# Altium project Lucas Emanuel - PCEIoT.PrjPcb (part 2 of 2)

## Sheet [6] RgbLed.SchDoc
size A3; DocumentNumber: 6; SheetNumber: 6; SheetTotal: 9
Used 3 times, as channels ButtonsAndLeds/"RGB LEDs"1, ButtonsAndLeds/"RGB LEDs"2, ButtonsAndLeds/"RGB LEDs"3. Parts and nets are listed once, with the designators drawn on the sheet.
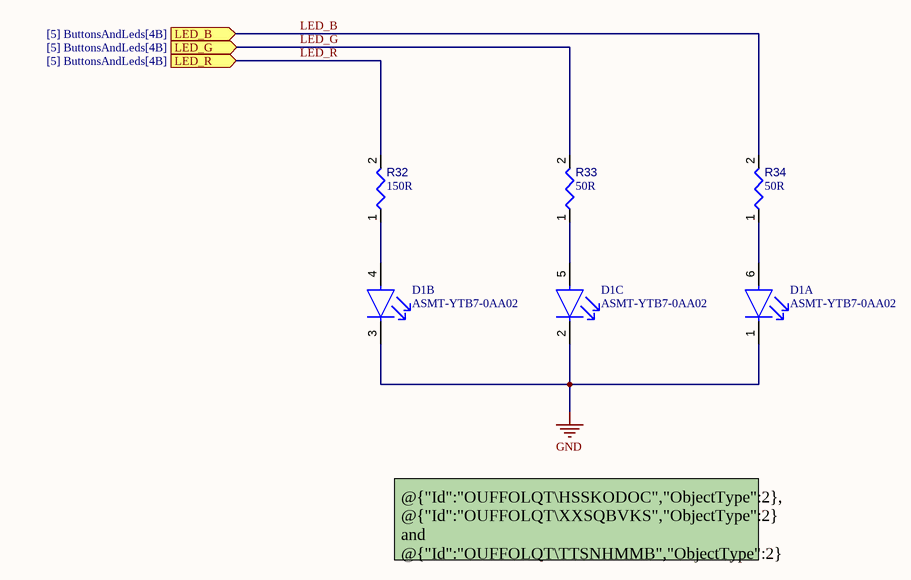
[diagram p7: [6] RgbLed.SchDoc]

### Parts
D1  ASMT-YTB7-0AA02  [FP-PLCC-6-MFG]  (parts A,B,C of 3)
R32  value 150R  [RESC0603(1608)_L]  (hidden comment: CRCW0603150RFKEA)
R33  value 50R  [RESC0603(1608)_L]  (hidden comment: CRCW060350R0FKEA)
R34  value 50R  [RESC0603(1608)_L]  (hidden comment: CRCW060350R0FKEA)

### Ports
LED_B (in, see [5] ButtonsAndLeds[4B]), LED_G (in, see [5] ButtonsAndLeds[4B]), LED_R (in, see [5] ButtonsAndLeds[4B])

### Nets
GND: D1.1(Cathode(Blue)) D1.2(Cathode(Green)) D1.3(Cathode(Red))
LED_B: R34.2 ; port LED_B
LED_G: R33.2 ; port LED_G
LED_R: R32.2 ; port LED_R
NetD1_4: D1.4(Anode(Red)) R32.1
NetD1_5: D1.5(Anode(Green)) R33.1
NetD1_6: D1.6(Anode(Blue)) R34.1

### Channels
ButtonsAndLeds/"RGB LEDs"1: designators end in A; ports LED_B=LED_B LED_G=LED_G LED_R=LED_R
ButtonsAndLeds/"RGB LEDs"2: designators end in B; ports LED_B=LED_B LED_G=LED_G LED_R=LED_R
ButtonsAndLeds/"RGB LEDs"3: designators end in C; ports LED_B=LED_B LED_G=LED_G LED_R=LED_R

### Notes on the sheet
- @{"Id":"OUFFOLQT\HSSKODOC","ObjectType":2}, @{"Id":"OUFFOLQT\XXSQBVKS","ObjectType":2} and @{"Id":"OUFFOLQT\TTSNHMMB","ObjectType":2} calculated based on voltage drops for each LED for a same current amount of 10mA.
- REVISION
- DESCRIPTION
- DATE
- APPROVED
- ADDRESS
- PROJECT
- VERSION
- TITLE
- A3
- SIZE
- SCALE
- DOCUMENT NAME:
- DOCUMENT REVISION:
- OF
- SHEET:
- PROJECT REVISION:

### Library data of the parts
D1 = CMP-007-00036-1: LED Tri-Color Blue/Green/Red 469nm/529nm/623nm Chip LED 6-Pin PLCC T/R; Lens Size: 2.3mm; Forward Voltage: 3.1V; Lens Transparency: Diffused; Dominant Wavelength: 469nm; Luminous Intensity: 384mcd; Viewing Angle: 120°; Color: Blue,Green,Red; Lens Style: Flat,Square,Diffused,Rectangular; Reverse Voltage: 4V; Number of LEDs: 3; Forward Current: 20mA; Reach SVHC Compliant: No; Case/Package: PLCC; Packaging: Cut Tape; Orientation: Top View; Height: 2mm; Length: 3mm; Contact Plating: Silver; Weight: 40mg; Min Operating Temperature: -40°C; Pins: 6; Series: -; Max Operating Temperature: 100°C; Package Quantity: 2000; Mounting Technology: Surface Mount; Width: 2.8mm; Test Current: 20mA
R32 = CMP-009-00179-1: SMD Chip Resistor, 150 Ohm, ± 1%, 100 mW, 0603 [1608 Metric], Thick Film, General Purpose; Voltage Rating (DC): 75V; Power Rating: 100mW; Temperature Coefficient: 100ppm/°C; Reach SVHC Compliant: Unknown; Height: 0.45mm; Package Quantity: 5000; Technology: THICK FILM; Case Code (Metric): 1608; Weight: 7.1E-05oz; Tolerance: 1%; Max Operating Temperature: 155°C; Military Standard: Not; Series: CRCW; Contact Plating: Tin; Number of Terminations: 2; Ratings: AEC-Q200; Features: Automotive AEC-Q200; Packaging: Tape and Reel; Resistor Type: Thick Film; Construction: Rectangular; Lead Free: Lead Free; Termination: SMD/SMT; Min Operating Temperature: -55°C; Max Power Dissipation: 100mW; Voltage Rating: 75V; Case/Package: 0603; Depth: 0.85mm; Width: 0.85mm; Radiation Hardening: No; Length: 1.55mm; Case Code (Imperial): 0603; RoHS Compliant: Yes; Resistance Tolerance: 1%
R33 R34 = CMP-009-00180-1: SMD Chip Resistor, 50 Ohm, ± 1%, 100 mW, 0603 [1608 Metric], Thick Film, General Purpose; Voltage Rating (DC): 75V; Temperature Coefficient: 100ppm/°C; Max Power Dissipation: 100mW; Termination: SMD/SMT; Height: 0.45mm; Features: Automotive AEC-Q200; Package Quantity: 5000; Max Operating Temperature: 155°C; Pins: 2; Resistance Tolerance: 1%; Depth: 0.85mm; Width: 0.85mm; Contact Plating: Tin; RoHS Compliant: Yes; Case Code (Metric): 1608; Length: 1.55mm; Radiation Hardening: No; Resistor Type: Thick Film; Min Operating Temperature: -55°C; Tolerance: 1%; Reach SVHC Compliant: No; Number of Terminations: 2; Weight: 7.1E-05oz; Packaging: Tape and Reel; Power Rating: 100mW; Case Code (Imperial): 0603; Technology: THICK FILM; Voltage Rating: 75V; Lead Free: Lead Free; Series: CRCW; Case/Package: 0603

## Sheet [8] Conectors.SchDoc
size A3; DocumentNumber: 8; SheetNumber: 8; SheetTotal: 9
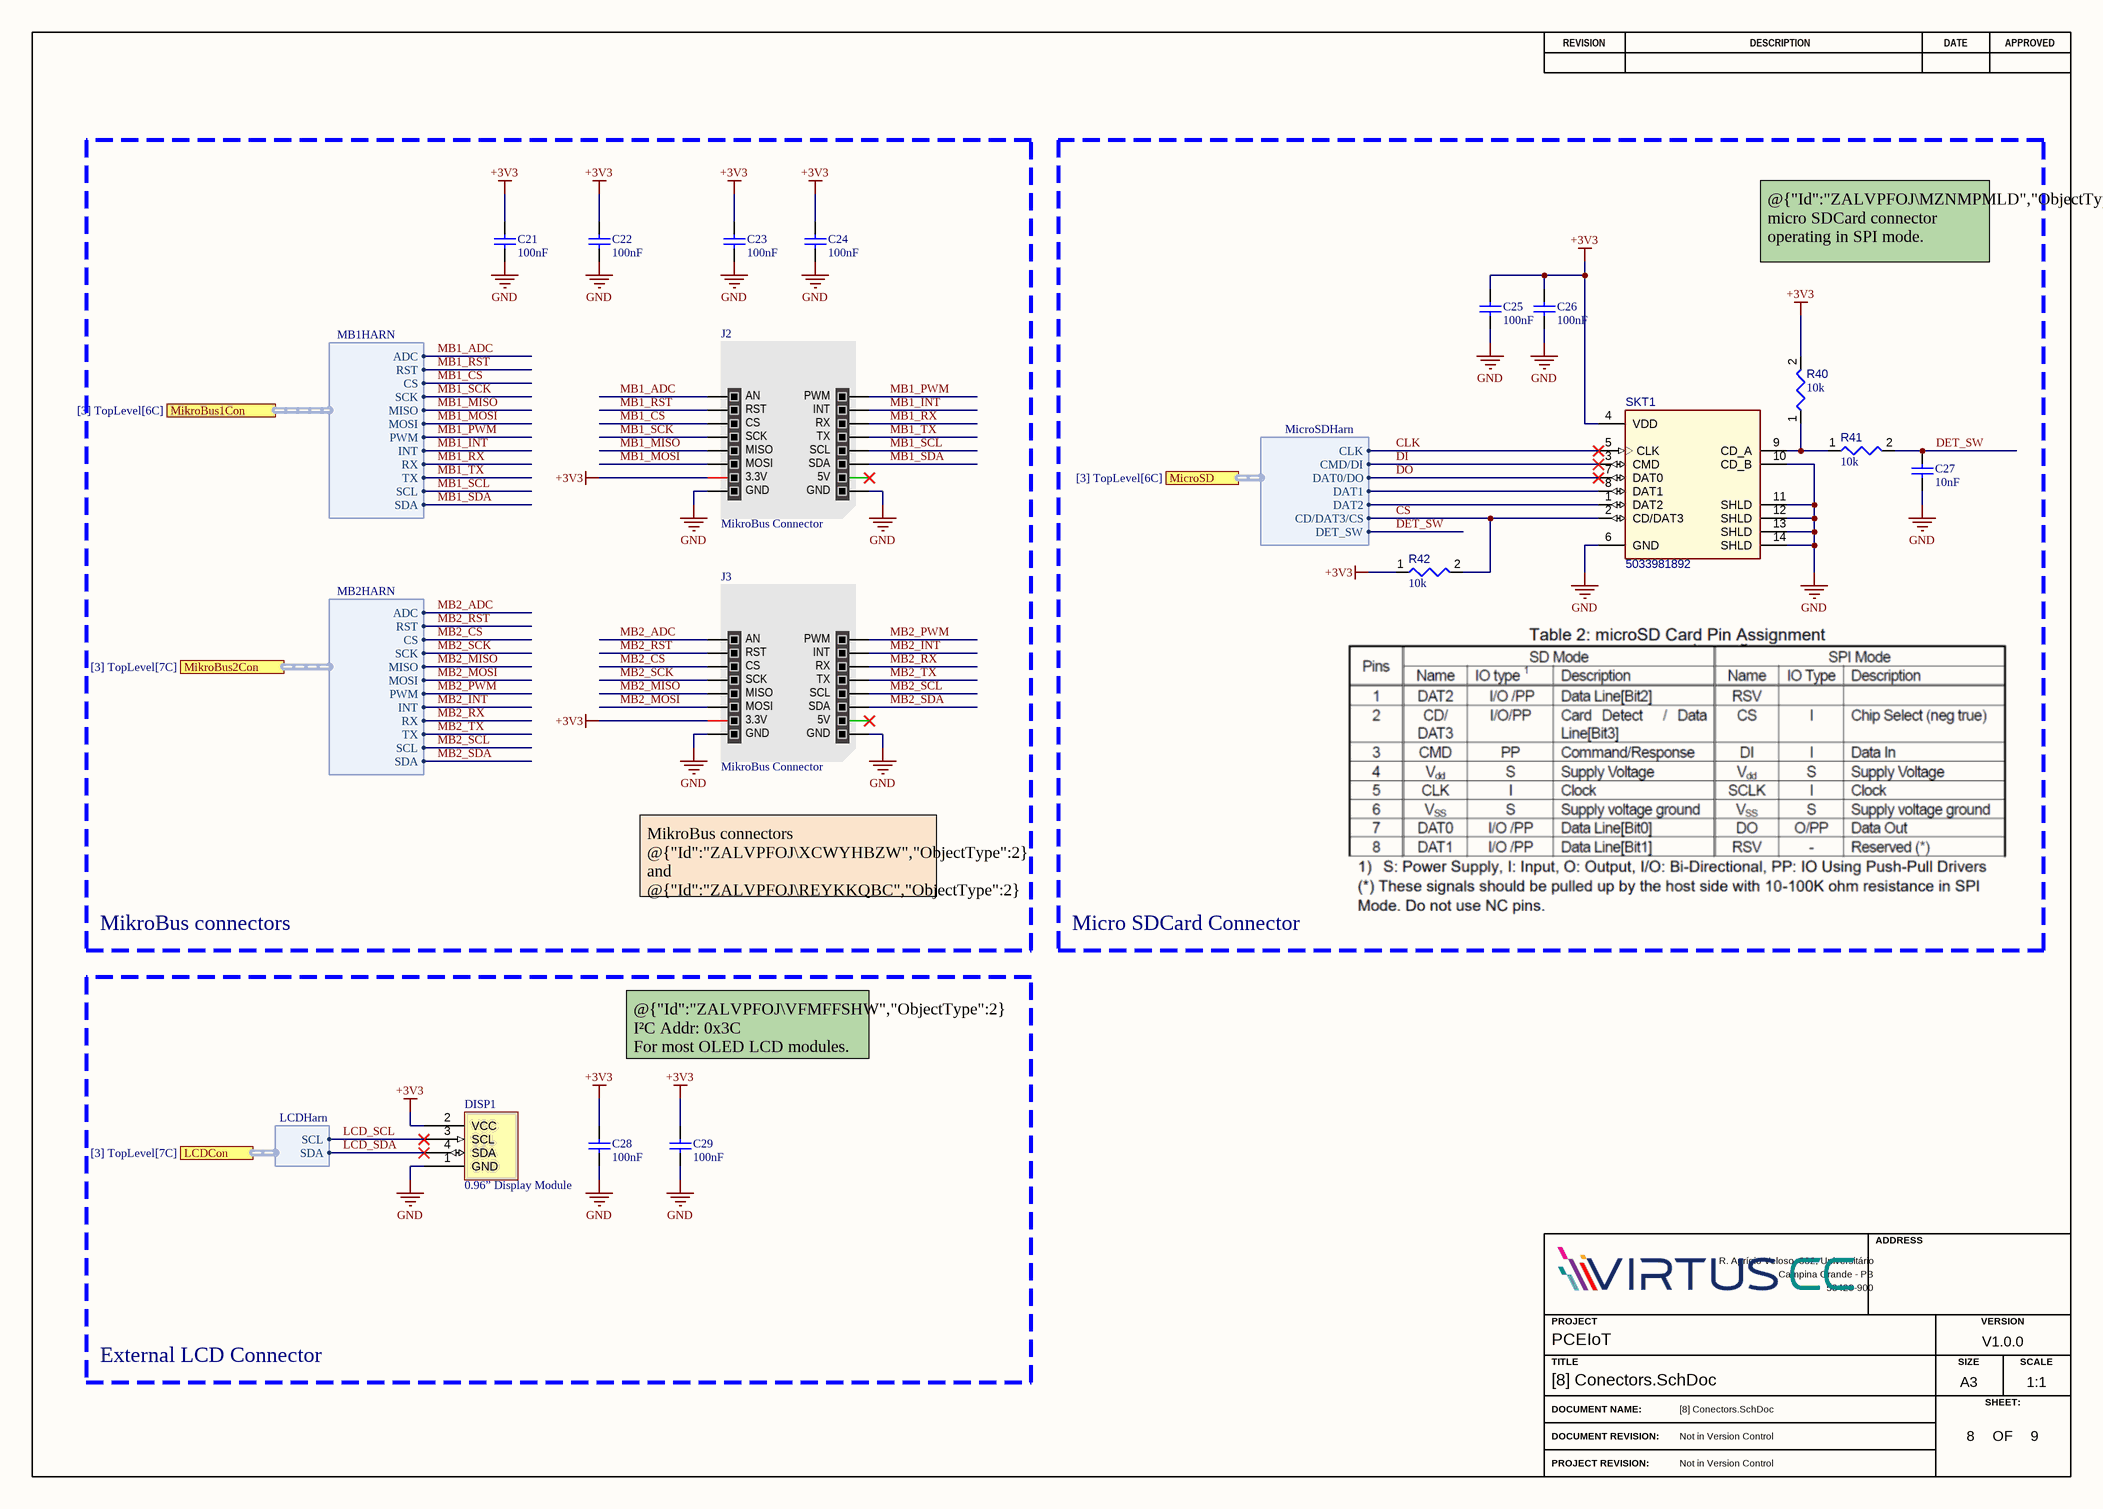
[diagram p8: [8] Conectors.SchDoc]

### Parts
C21  value 100nF  [CAPC0603(1608)100_L]  (hidden comment: VJ0603Y104MXJCW1BC)
C22  value 100nF  [CAPC0603(1608)100_L]  (hidden comment: VJ0603Y104MXJCW1BC)
C23  value 100nF  [CAPC0603(1608)100_L]  (hidden comment: VJ0603Y104MXJCW1BC)
C24  value 100nF  [CAPC0603(1608)100_L]  (hidden comment: VJ0603Y104MXJCW1BC)
C25  value 100nF  [CAPC0603(1608)100_L]  (hidden comment: VJ0603Y104MXJCW1BC)
C26  value 100nF  [CAPC0603(1608)100_L]  (hidden comment: VJ0603Y104MXJCW1BC)
C27  value 10nF  [CAPC0603(1608)100_L]  (hidden comment: VJ0603Y103KXAAC)
C28  value 100nF  [CAPC0603(1608)100_L]  (hidden comment: VJ0603Y104MXJCW1BC)
C29  value 100nF  [CAPC0603(1608)100_L]  (hidden comment: VJ0603Y104MXJCW1BC)
DISP1  0.96” Display Module  [New footprint 1]
J2  MikroBus Connector  [New footprint 1]
J3  MikroBus Connector  [New footprint 1]
R40  value 10k  [RESC0603(1608)_L]  (hidden comment: Resistor 10k +/-1% 0603 100 mW)
R41  value 10k  [RESC0603(1608)_L]  (hidden comment: Resistor 10k +/-1% 0603 100 mW)
R42  value 10k  [RESC0603(1608)_L]  (hidden comment: Resistor 10k +/-1% 0603 100 mW)
SKT1  5033981892  [MOLX-5033981892_V]

### Blocks framed on the sheet
MikroBus connectors: C21-C24 J2 J3
Micro SDCard Connector: C25-C27 R40-R42 SKT1
External LCD Connector: C28 C29 DISP1

### Ports
LCDCon (harness LCDHarn, see [3] TopLevel[7C]), MicroSD (harness MicroSDHarn, see [3] TopLevel[6C]), MikroBus1Con (harness MB1HARN, see [3] TopLevel[6C]), MikroBus2Con (harness MB2HARN, see [3] TopLevel[7C])

### Harnesses
MB2HARN: ADC, RST, CS, SCK, MISO, MOSI, PWM, INT, RX, TX, SCL, SDA
MB1HARN: ADC, RST, CS, SCK, MISO, MOSI, PWM, INT, RX, TX, SCL, SDA
MicroSDHarn: CLK, CMD/DI, DAT0/DO, DAT1, DAT2, CD/DAT3/CS, DET_SW
LCDHarn: SCL, SDA

### Nets
+3V3: C21.2 C22.2 C23.2 C24.2 C25.2 C26.2 C28.2 C29.2 DISP1.2(VCC) J2.7(3.3V) J3.7(3.3V) R40.2 R42.1 SKT1.4(VDD)
GND: C21.1 C22.1 C23.1 C24.1 C25.1 C26.1 C27.1 C28.1 C29.1 DISP1.1(GND) J2.8(GND) J2.9(GND) J3.8(GND) J3.9(GND) SKT1.6(GND) SKT1.10(CD_B) SKT1.11(SHLD) SKT1.12(SHLD) SKT1.13(SHLD) SKT1.14(SHLD)
CLK: J2.4(SCK) J3.4(SCK) SKT1.5(CLK) ; port MikroBus2Con.SCK, port MikroBus1Con.SCK, port MicroSD.CLK  [also labelled MB1_SCK, MB2_SCK]
CS: R42.2 SKT1.2(CD/DAT3) ; port MicroSD.CD/DAT3/CS
DET_SW: C27.2 R41.2 ; port MicroSD.DET_SW
DI: SKT1.3(CMD) ; port MicroSD.CMD/DI
DO: SKT1.7(DAT0) ; port MicroSD.DAT0/DO
LCD_SCL: DISP1.3(SCL) J2.12(SCL) J3.12(SCL) ; port MikroBus2Con.SCL, port MikroBus1Con.SCL, port LCDCon.SCL  [also labelled MB1_SCL, MB2_SCL]  [project net GP5/I2C0_SCL]
LCD_SDA: DISP1.4(SDA) J2.11(SDA) J3.11(SDA) ; port MikroBus2Con.SDA, port MikroBus1Con.SDA, port LCDCon.SDA  [also labelled MB1_SDA, MB2_SDA]  [project net GP4/I2C0_SDA]
MB1_ADC: J2.1(AN) ; port MikroBus1Con.ADC  [project net GP26/MB1_ADC]
MB1_CS: J2.3(CS) ; port MikroBus1Con.CS  [project net GP14/MB1_CS]
MB1_INT: J2.15(INT) ; port MikroBus1Con.INT  [project net GP3/MB1_INT]
MB1_MISO: J2.5(MISO) J3.5(MISO) ; port MikroBus2Con.MISO, port MikroBus1Con.MISO  [also labelled MB2_MISO]
MB1_MOSI: J2.6(MOSI) J3.6(MOSI) ; port MikroBus2Con.MOSI, port MikroBus1Con.MOSI  [also labelled MB2_MOSI]
MB1_PWM: J2.16(PWM) ; port MikroBus1Con.PWM  [project net GP2/MB1_PWM]
MB1_RST: J2.2(RST) ; port MikroBus1Con.RST  [project net GP6/MB1_RST]
MB1_RX: J2.14(RX) ; port MikroBus1Con.RX  [project net GP1/MB1_RX]
MB1_TX: J2.13(TX) ; port MikroBus1Con.TX  [project net GP0/MB1_TX]
MB2_ADC: J3.1(AN) ; port MikroBus2Con.ADC  [project net GP27/MB2_ADC]
MB2_CS: J3.3(CS) ; port MikroBus2Con.CS  [project net GP22/MB2_CS]
MB2_INT: J3.15(INT) ; port MikroBus2Con.INT  [project net GP21/MB2_INT]
MB2_PWM: J3.16(PWM) ; port MikroBus2Con.PWM  [project net GP7/MB2_PWM]
MB2_RST: J3.2(RST) ; port MikroBus2Con.RST  [project net GP20/MB2_RST]
MB2_RX: J3.14(RX) ; port MikroBus2Con.RX  [project net GP9/MB2_RX]
MB2_TX: J3.13(TX) ; port MikroBus2Con.TX  [project net GP8/MB2_TX]
NetR40_1: R40.1 R41.1 SKT1.9(CD_A)
NetSKT1_1: SKT1.1(DAT2) ; port MicroSD.DAT2
NetSKT1_8: SKT1.8(DAT1) ; port MicroSD.DAT1

Not connected (* = marked no-connect by the designer): J2 10(5V)*; J3 10(5V)*

### Notes on the sheet
- @{"Id":"ZALVPFOJ\MZNMPMLD","ObjectType":2} micro SDCard connector operating in SPI mode.
- MikroBus connectors @{"Id":"ZALVPFOJ\XCWYHBZW","ObjectType":2} and @{"Id":"ZALVPFOJ\REYKKQBC","ObjectType":2} only
  compatible with modules operating in 3.3V. 5V power supply pin is floating
- @{"Id":"ZALVPFOJ\VFMFFSHW","ObjectType":2} I²C Addr: 0x3C
  For most OLED LCD modules.
- REVISION
- DESCRIPTION
- DATE
- APPROVED
- ADDRESS
- PROJECT
- VERSION
- TITLE
- A3
- SIZE
- SCALE
- DOCUMENT NAME:
- DOCUMENT REVISION:
- OF
- SHEET:
- PROJECT REVISION:

### Library data of the parts
C21-C26 C28 C29 = CMP-001-00085-1: Multilayer Ceramic Capacitor, 0.1 uF, 16 V, ± 20%, X7R, 0603 [1608 Metric]; Dielectric Material: Tantalum; Voltage Rating: 16V; Packaging: Tape and Reel; Min Operating Temperature: -55°C; Case/Package: 0603; Length: 1.6mm; Termination: SMD/SMT; Height: 0.95mm; Mounting Technology: Surface Mount; Width: 0.8mm; Case Code (Imperial): 0603; Construction: Flat; Lead Free: Lead Free; Package Quantity: 4000; Max Operating Temperature: 125°C; Dielectric: X7R; RoHS Compliant: Yes; Depth: 0.8mm; Tolerance: 20%; Series: VJ; Case Code (Metric): 1608; Voltage Rating (DC): 16V
C27 = CMP-001-00084-1: Multilayer Ceramic Capacitor, 0.01 uF, 50 V, ± 10%, X7R, 0603 [1608 Metric]; Voltage Rating: 50V; Height: 0.92mm; Voltage Rating (DC): 50V; Depth: 0.8mm; Case Code (Imperial): 0603; Packaging: Tape and Reel; Length: 1.6mm; Max Operating Temperature: 125°C; Min Operating Temperature: -55°C; Case/Package: 0603; Pins: 2; Series: VJ; Thickness: 0.036inch; Weight: 7.1E-05oz; Reach SVHC Compliant: Unknown; Termination: SMD/SMT; Package Quantity: 1; RoHS Compliant: Yes; Mounting Technology: Surface Mount; Construction: Flat; Voltage: 50V; Lead Free: Lead Free; Width: 0.031inch; Case Code (Metric): 1608; Tolerance: 10%; Dielectric: X7R
DISP1 = CMP-003-00030-5: 0.96 Inch I2C OLED Display Module
J2 J3 = CMP-002-00071-3: MikroBus shield pico
R40-R42 = CMP-009-00017-7: Chip Resistor, 10 KOhm, +/- 1%, 01 W, -55 to 155 degC, 0603 (1608 Metric); Power: 100mW; Voltage Rating: 50V; Mounting Technology: SM; Max Operating Temperature: 155°C; Case/Package: 0603; Tolerance: 1%; RoHS Compliant: True; Pins: 2; Min Operating Temperature: -55°C
SKT1 = CMP-002-00049-5: Micro SD Card Connector, Pitch 1.1 mm, 8 Position, Height 1.4 mm, -25 to 85 degC, RoHS, Tape and Reel; Pins: 14

## Nets that join several sheets
+3V3: [3] TopLevel (+3V3.1 R1.1 R2.1 U1.36), [4] Sensors (14 pins), [5] ButtonsAndLeds (13 pins), [8] Conectors (14 pins)
GND: [3] TopLevel (15 pins), [7] PowerManagement (8 pins), [4] Sensors (16 pins), [5] ButtonsAndLeds (18 pins), ButtonsAndLeds/"RGB LEDs"1 (D1A.1 D1A.2 D1A.3), ButtonsAndLeds/"RGB LEDs"2 (D1B.1 D1B.2 D1B.3), ButtonsAndLeds/"RGB LEDs"3 (D1C.1 D1C.2 D1C.3), [8] Conectors (20 pins)
VBUS: [3] TopLevel (U1.40 VBUS.1), [7] PowerManagement (5 pins)
VREF: [3] TopLevel (U1.35 VREF.1), [7] PowerManagement (U8.1)
VSYS: [3] TopLevel (R3.1 U1.39 VSYS.1), [7] PowerManagement (Q1.2)
CLK: [3] TopLevel (SCK.1 U1.24), [4] Sensors (U2.13), [8] Conectors (J2.4 J3.4 SKT1.5)
CS: [3] TopLevel (SCS.1 U1.22), [8] Conectors (R42.2 SKT1.2)
DET_SW: [3] TopLevel (SW.1 U1.20), [8] Conectors (C27.2 R41.2)
DI: [3] TopLevel (MOSI.1 R5.1 R8.1 U1.25), [4] Sensors (U2.14), [8] Conectors (SKT1.3)
DO: [3] TopLevel (MISO.1 R4.1 R7.1 U1.21), [4] Sensors (U2.1), [8] Conectors (SKT1.7)
GP0/MB1_TX: [3] TopLevel (TX1.1 U1.1), [8] Conectors (J2.13)
GP1/MB1_RX: [3] TopLevel (RX1.1 U1.2), [8] Conectors (J2.14)
GP2/MB1_PWM: [3] TopLevel (PWM1.1 U1.4), [8] Conectors (J2.16)
GP3/MB1_INT: [3] TopLevel (INT1.1 U1.5), [8] Conectors (J2.15)
GP4/I2C0_SDA: [3] TopLevel (R2.2 SDA.1 U1.6), [4] Sensors (U3.8 U5.2 U6.1), [5] ButtonsAndLeds (U7.24), [8] Conectors (DISP1.4 J2.11 J3.11)
GP5/I2C0_SCL: [3] TopLevel (R1.2 SCL.1 U1.7), [4] Sensors (U3.5 U5.3 U6.2), [5] ButtonsAndLeds (U7.25), [8] Conectors (DISP1.3 J2.12 J3.12)
GP6/MB1_RST: [3] TopLevel (RST1.1 U1.9), [8] Conectors (J2.2)
GP7/MB2_PWM: [3] TopLevel (PWM2.1 U1.10), [8] Conectors (J3.16)
GP8/MB2_TX: [3] TopLevel (TX2.1 U1.11), [8] Conectors (J3.13)
GP9/MB2_RX: [3] TopLevel (RX2.1 U1.12), [8] Conectors (J3.14)
GP10/MOT_CSn: [3] TopLevel (ICS.1 U1.14), [4] Sensors (U2.12)
GP12/ICM_INT1: [3] TopLevel (IINT.1 U1.16), [4] Sensors (R10.2 U2.4)
GP13/OPT_INT: [3] TopLevel (OINT.1 U1.17), [4] Sensors (R9.1 U3.7)
GP14/MB1_CS: [3] TopLevel (CS1.1 U1.19), [8] Conectors (J2.3)
GP20/MB2_RST: [3] TopLevel (RST2.1 U1.26), [8] Conectors (J3.2)
GP21/MB2_INT: [3] TopLevel (INT2.1 U1.27), [8] Conectors (J3.15)
GP22/MB2_CS: [3] TopLevel (CS2.1 U1.29), [8] Conectors (J3.3)
GP26/MB1_ADC: [3] TopLevel (ADC1.1 U1.31), [8] Conectors (J2.1)
GP27/MB2_ADC: [3] TopLevel (ADC2.1 U1.32), [8] Conectors (J3.1)
LED_B: [5] ButtonsAndLeds (U7.8), ButtonsAndLeds/"RGB LEDs"1 (R34A.2)
LED_B: [5] ButtonsAndLeds (U7.15), ButtonsAndLeds/"RGB LEDs"2 (R34B.2)
LED_B: [5] ButtonsAndLeds (U7.22), ButtonsAndLeds/"RGB LEDs"3 (R34C.2)
LED_G: [5] ButtonsAndLeds (U7.7), ButtonsAndLeds/"RGB LEDs"1 (R33A.2)
LED_G: [5] ButtonsAndLeds (U7.14), ButtonsAndLeds/"RGB LEDs"2 (R33B.2)
LED_G: [5] ButtonsAndLeds (U7.21), ButtonsAndLeds/"RGB LEDs"3 (R33C.2)
LED_R: [5] ButtonsAndLeds (U7.6), ButtonsAndLeds/"RGB LEDs"1 (R32A.2)
LED_R: [5] ButtonsAndLeds (U7.13), ButtonsAndLeds/"RGB LEDs"2 (R32B.2)
LED_R: [5] ButtonsAndLeds (U7.20), ButtonsAndLeds/"RGB LEDs"3 (R32C.2)
MB1_MISO: [3] TopLevel (MB_MISO.1 R4.2 R5.2), [8] Conectors (J2.5 J3.5)
MB1_MOSI: [3] TopLevel (MB_MOSI.1 R7.2 R8.2), [8] Conectors (J2.6 J3.6)
MIC_OUT: [3] TopLevel (MOUT.1 P1.1), [4] Sensors (5 pins)

## Assembly variants
Manufacturing: all parts fitted
Fabricação: not fitted DISP1 J2 J3 R5 R8 R13 R26 R27